# EAGLE design SixPotatoeV7 (EAGLE 9.6.0)
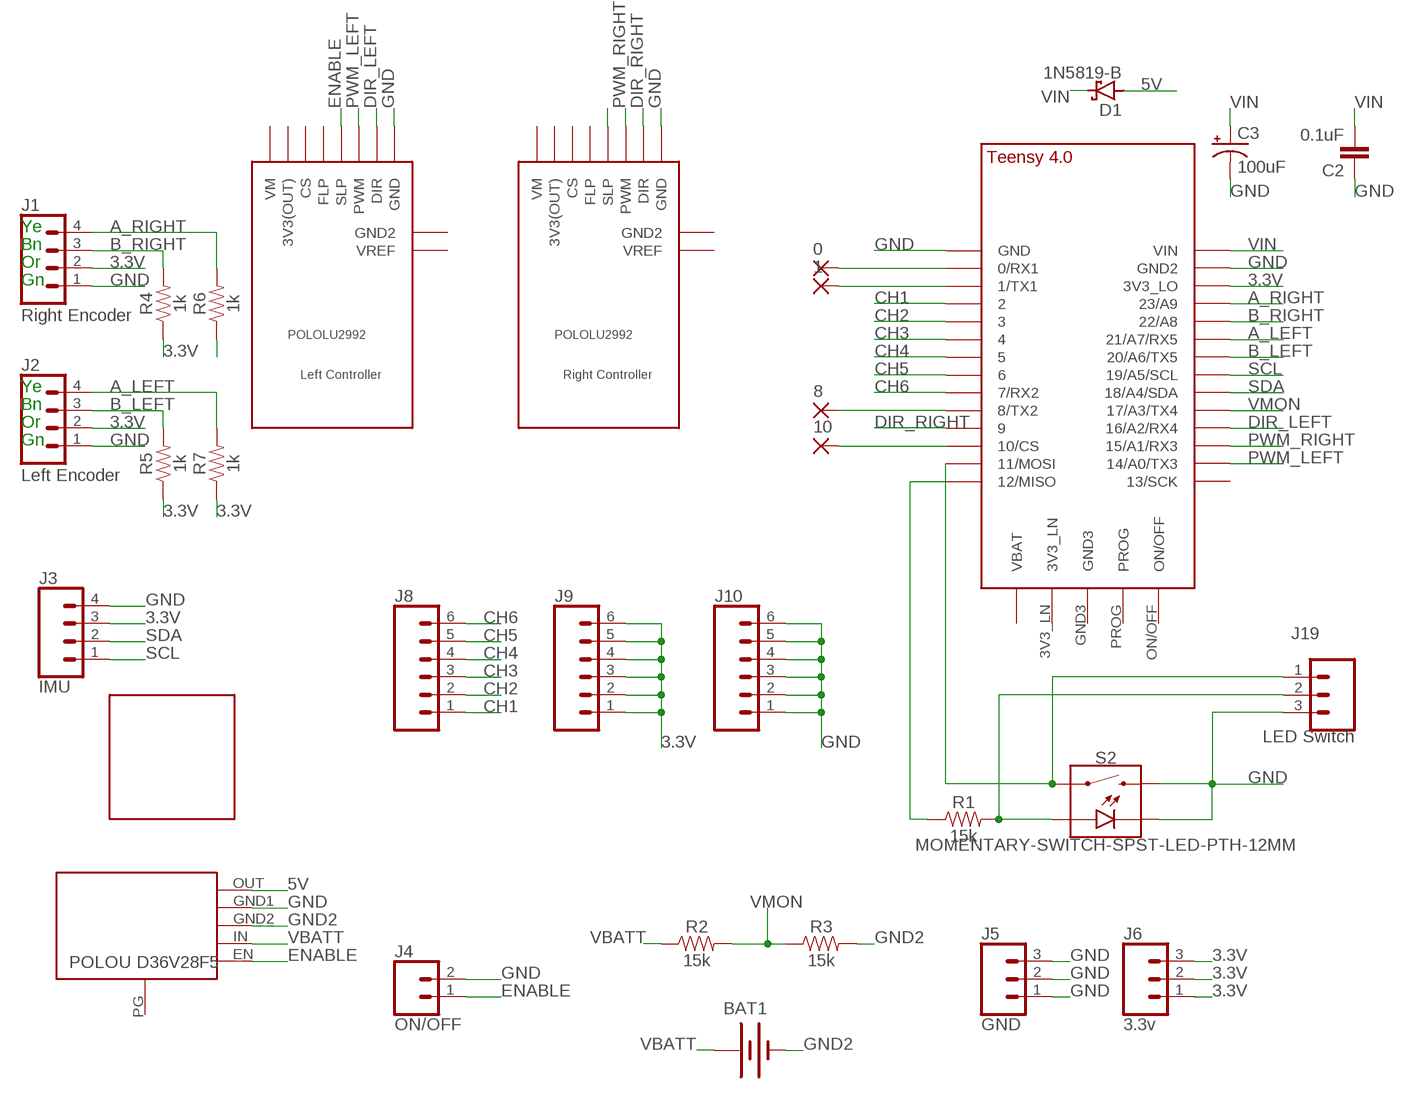
[diagram p0: schematic, sheet 1]

## Parts
0  2,15/1,0  [2,15/1,0]
1  2,15/1,0  [2,15/1,0]
8  2,15/1,0  [2,15/1,0]
10  2,15/1,0  [2,15/1,0]
BAT1  XT60_MALE  [XT60]
C2  0.1uF  0.1UF-KIT-EZ-50V-20%  [CAP-PTH-SMALL-KIT]
C3  100uF  100UF-POLAR-RADIAL-2.5MM-25V-20%  [CPOL-RADIAL-2.5MM-6.5MM]
D1  1N5819-B  [DO41-7.6]
J1  CONN_04  [1X04]
J2  CONN_04  [1X04]
J3  IMU  CONN_04  [1X04]
J4  ON/OFF  CONN_02  [1X02]
J5  GND  CONN_03  [1X03]
J6  3.3v  CONN_03  [1X03]
J8  CONN_06NO_SILK_FEMALE_PTH  [1X06_NO_SILK]
J9  CONN_06NO_SILK_FEMALE_PTH  [1X06_NO_SILK]
J10  CONN_06NO_SILK_FEMALE_PTH  [1X06_NO_SILK]
J19  CONN_03  [1X03]
R1  15k  15KOHM-HORIZ-1/4W-5%  [AXIAL-0.3]
R2  15k  15KOHM-HORIZ-1/4W-5%  [AXIAL-0.3]
R3  15k  15KOHM-HORIZ-1/4W-5%  [AXIAL-0.3]
R4  1k  1KOHM-HORIZ-1/4W-1%  [AXIAL-0.3]
R5  1k  1KOHM-HORIZ-1/4W-1%  [AXIAL-0.3]
R6  1k  1KOHM-HORIZ-1/4W-1%  [AXIAL-0.3]
R7  1k  1KOHM-HORIZ-1/4W-1%  [AXIAL-0.3]
S2  MOMENTARY-SWITCH-SPST-LED-PTH-12MM  [TACTILE_SWITCH_LED_PTH_12MM]
U$1  TEENSY_4.0  [TEENSY_4.0]
U$2  Left Controller  POLOLU2992_2  [POLOLU2992_2]
U$3  Right Controller  POLOLU2992_2  [POLOLU2992_2]
U$4  POLOU3782  [POLOU3782]
U$5  SEN15335_NO_PTH  [SEN15335_NO_PTH]

## Nets
3.3V: J1.2 J2.2 J3.3 J6.1 J6.2 J6.3 J9.1 J9.2 J9.3 J9.4 J9.5 J9.6 R4.P$1 R5.P$1 R6.P$1 R7.P$1 U$1.3V3_LO
5V: D1.A U$4.OUT
A_LEFT: J2.4 R7.P$2 U$1.21/A7(21/A7/RX5)
A_RIGHT: J1.4 R6.P$2 U$1.23/A9
B_LEFT: J2.3 R5.P$2 U$1.20/A6(20/A6/TX5)
B_RIGHT: J1.3 R4.P$2 U$1.22/A8
CH1: J8.1 U$1.2
CH2: J8.2 U$1.3/CANTX
CH3: J8.3 U$1.4/CANRX
CH4: J8.4 U$1.5
CH5: J8.5 U$1.6
CH6: J8.6 U$1.7(7/RX2)
DIR_LEFT: U$1.16/A2(16/A2/RX4) U$2.DIR
DIR_RIGHT: U$1.9/CS U$3.DIR
ENABLE: J4.1 U$2.SLP U$3.SLP U$4.EN
GND: C2.1 C3.2(-) J1.1 J2.1 J3.4 J4.2 J5.1 J5.2 J5.3 J10.1 J10.2 J10.3 J10.4 J10.5 J10.6 J19.3 S2.2 S2.C U$1.GND U$1.GND2 U$2.GND U$3.GND U$4.GND1
GND2: BAT1.- R3.P$2 U$4.GND2
N$1: 0.1(P) U$1.0/RX(0/RX1)
N$2: J19.2 R1.P$2 S2.A
N$3: R1.P$1 U$1.12/MISO
N$4: J19.1 S2.4 U$1.11/MOSI
N$5: 1.1(P) U$1.1/TX(1/TX1)
N$6: 10.1(P) U$1.10/CS
N$7: 8.1(P) U$1.8(8/TX2)
PWM_LEFT: U$1.14/A0(14/A0/TX3) U$2.PWM
PWM_RIGHT: U$1.15/A1(15/A1/RX3) U$3.PWM
SCL: J3.1 U$1.19/A5/SCL
SDA: J3.2 U$1.18/A4/SDA
VBATT: BAT1.+ R2.P$1 U$4.IN
VIN: C2.2 C3.1(+) D1.C U$1.VIN
VMON: R2.P$2 R3.P$1 U$1.17/A3(17/A3/TX4)
Unconnected: U$1.3V3_LN U$1.13/SCK U$1.GND3 U$1.ON/OFF U$1.PROG U$1.VBAT\(VBAT) U$2.3V3(OUT) U$2.CS U$2.FLP U$2.GND2 U$2.VM U$2.VREF U$3.3V3(OUT) U$3.CS U$3.FLP U$3.GND2 U$3.VM U$3.VREF U$4.PG

## Notes on the sheet
- Ye
- Bn
- Or
- Gn
- Ye
- Bn
- Or
- Gn

## Library data of the parts
0 1 8 10 = wirepad:2,15/1,0: THROUGH-HOLE PAD
BAT1 = Tristan+Robitaille's+Library:XT60_MALE: Vertical Mount Through-Hole Male (for female battery) XT60 Connector
C2 = SparkFun-Capacitors:0.1UF: 0.1µF ceramic capacitors A capacitor is a passive two-terminal electrical component used to store electrical energy temporarily in an electric field.; PROD_ID: CAP-08370
C3 = SparkFun-Capacitors:100UF-POLAR: 100µF polarized capacitors A capacitor is a passive two-terminal electrical component used to store electrical energy temporarily in an electric field.; PROD_ID: CAP-08439
D1 = diode:1N581*: 1.0A SCHOTTKY BARRIER RECTIFIER Source: http://www.diodes.com/datasheets/ds23001.pdf
J1 = SparkFun-Connectors:CONN_04: Multi connection point. Often used as Generic Header-pin footprint for 0.1 inch spaced/style header connections On any of the 0.1 inch spaced packages, you can populate with these: Break Away Headers - Straight <https://www.sparkfun.com/products/116> (PRT-00116) Break Away Male Headers - Right Angle <https://www.sparkfun.com/products/553> (PRT-00553) Female Headers <https://www.sparkfun.com/products/115> (PRT-00115) Break Away Headers - Machine Pin <https://www.sparkfun.com/products/117> (PRT-00117) Break Away Female Headers - Swiss Machine Pin <https://www.sparkfun.com/products/743> (PRT-00743) For SCREWTERMINALS and SPRING TERMINALS visit here: Screw Terimnals on SparkFun.com <https://www.sparkfun.com/search/results?term=Screw+Terminals> (5mm/3.5mm/2.54mm spacing) This device is also useful as a general connection point to wire up your design to another part of your project. Our various solder wires solder well into these plated through hole pads. Hook-Up Wire - Assortment (Stranded, 22 AWG) <https://www.sparkfun.com/products/11375> (PRT-11375) Hook-Up Wire - Assortment (Solid Core, 22 AWG) <https://www.sparkfun.com/products/11367> (PRT-11367) View the entire wire category on our website here <https://www.sparkfun.com/categories/141> Special notes: Molex polarized connector foot print use with SKU : PRT-08231 with associated crimp pins and housings. 1MM SMD Version SKU: PRT-10208; ID: Right Encoder; PROD_ID: CONN-09696
J2 = SparkFun-Connectors:CONN_04: Multi connection point. Often used as Generic Header-pin footprint for 0.1 inch spaced/style header connections On any of the 0.1 inch spaced packages, you can populate with these: Break Away Headers - Straight <https://www.sparkfun.com/products/116> (PRT-00116) Break Away Male Headers - Right Angle <https://www.sparkfun.com/products/553> (PRT-00553) Female Headers <https://www.sparkfun.com/products/115> (PRT-00115) Break Away Headers - Machine Pin <https://www.sparkfun.com/products/117> (PRT-00117) Break Away Female Headers - Swiss Machine Pin <https://www.sparkfun.com/products/743> (PRT-00743) For SCREWTERMINALS and SPRING TERMINALS visit here: Screw Terimnals on SparkFun.com <https://www.sparkfun.com/search/results?term=Screw+Terminals> (5mm/3.5mm/2.54mm spacing) This device is also useful as a general connection point to wire up your design to another part of your project. Our various solder wires solder well into these plated through hole pads. Hook-Up Wire - Assortment (Stranded, 22 AWG) <https://www.sparkfun.com/products/11375> (PRT-11375) Hook-Up Wire - Assortment (Solid Core, 22 AWG) <https://www.sparkfun.com/products/11367> (PRT-11367) View the entire wire category on our website here <https://www.sparkfun.com/categories/141> Special notes: Molex polarized connector foot print use with SKU : PRT-08231 with associated crimp pins and housings. 1MM SMD Version SKU: PRT-10208; ID: Left Encoder; PROD_ID: CONN-09696
J3 = SparkFun-Connectors:CONN_04: Multi connection point. Often used as Generic Header-pin footprint for 0.1 inch spaced/style header connections On any of the 0.1 inch spaced packages, you can populate with these: Break Away Headers - Straight <https://www.sparkfun.com/products/116> (PRT-00116) Break Away Male Headers - Right Angle <https://www.sparkfun.com/products/553> (PRT-00553) Female Headers <https://www.sparkfun.com/products/115> (PRT-00115) Break Away Headers - Machine Pin <https://www.sparkfun.com/products/117> (PRT-00117) Break Away Female Headers - Swiss Machine Pin <https://www.sparkfun.com/products/743> (PRT-00743) For SCREWTERMINALS and SPRING TERMINALS visit here: Screw Terimnals on SparkFun.com <https://www.sparkfun.com/search/results?term=Screw+Terminals> (5mm/3.5mm/2.54mm spacing) This device is also useful as a general connection point to wire up your design to another part of your project. Our various solder wires solder well into these plated through hole pads. Hook-Up Wire - Assortment (Stranded, 22 AWG) <https://www.sparkfun.com/products/11375> (PRT-11375) Hook-Up Wire - Assortment (Solid Core, 22 AWG) <https://www.sparkfun.com/products/11367> (PRT-11367) View the entire wire category on our website here <https://www.sparkfun.com/categories/141> Special notes: Molex polarized connector foot print use with SKU : PRT-08231 with associated crimp pins and housings. 1MM SMD Version SKU: PRT-10208; PROD_ID: CONN-09696
J4 = SparkFun-Connectors:CONN_02: Multi connection point. Often used as Generic Header-pin footprint for 0.1 inch spaced/style header connections On any of the 0.1 inch spaced packages, you can populate with these: Break Away Headers - Straight <https://www.sparkfun.com/products/116> (PRT-00116) Break Away Male Headers - Right Angle <https://www.sparkfun.com/products/553> (PRT-00553) Female Headers <https://www.sparkfun.com/products/115> (PRT-00115) Break Away Headers - Machine Pin <https://www.sparkfun.com/products/117> (PRT-00117) Break Away Female Headers - Swiss Machine Pin <https://www.sparkfun.com/products/743> (PRT-00743) For SCREWTERMINALS and SPRING TERMINALS visit here: Screw Terimnals on SparkFun.com <https://www.sparkfun.com/search/results?term=Screw+Terminals> (5mm/3.5mm/2.54mm spacing) This device is also useful as a general connection point to wire up your design to another part of your project. Our various solder wires solder well into these plated through hole pads. Hook-Up Wire - Assortment (Stranded, 22 AWG) <https://www.sparkfun.com/products/11375> (PRT-11375) Hook-Up Wire - Assortment (Solid Core, 22 AWG) <https://www.sparkfun.com/products/11367> (PRT-11367) View the entire wire category on our website here <https://www.sparkfun.com/categories/141> Special notes: Molex polarized connector foot print use with: PRT-08233 with associated crimp pins and housings. 2.54_SCREWTERM for use with PRT-10571. 3.5mm Screw Terminal footprints for PRT-08084 5mm Screw Terminal footprints for use with PRT-08432
J5 J6 = SparkFun-Connectors:CONN_03: Multi connection point. Often used as Generic Header-pin footprint for 0.1 inch spaced/style header connections On any of the 0.1 inch spaced packages, you can populate with these: Break Away Headers - Straight <https://www.sparkfun.com/products/116> (PRT-00116) Break Away Male Headers - Right Angle <https://www.sparkfun.com/products/553> (PRT-00553) Female Headers <https://www.sparkfun.com/products/115> (PRT-00115) Break Away Headers - Machine Pin <https://www.sparkfun.com/products/117> (PRT-00117) Break Away Female Headers - Swiss Machine Pin <https://www.sparkfun.com/products/743> (PRT-00743) Stackable Header - 3 Pin (Female, 0.1") <https://www.sparkfun.com/products/13875> (PRT-13875) For SCREWTERMINALS and SPRING TERMINALS visit here: Screw Terimnals on SparkFun.com <https://www.sparkfun.com/search/results?term=Screw+Terminals> (5mm/3.5mm/2.54mm spacing) This device is also useful as a general connection point to wire up your design to another part of your project. Our various solder wires solder well into these plated through hole pads. Hook-Up Wire - Assortment (Stranded, 22 AWG) <https://www.sparkfun.com/products/11375> (PRT-11375) Hook-Up Wire - Assortment (Solid Core, 22 AWG) <https://www.sparkfun.com/products/11367> (PRT-11367) View the entire wire category on our website here <https://www.sparkfun.com/categories/141> Special notes: Molex polarized connector foot print use with SKU : PRT-08232 with associated crimp pins and housings.
J8-J10 = SparkFun-Connectors:CONN_06: Multi connection point. Often used as Generic Header-pin footprint for 0.1 inch spaced/style header connections On any of the 0.1 inch spaced packages, you can populate with these: Break Away Headers - Straight <https://www.sparkfun.com/products/116> (PRT-00116) Break Away Male Headers - Right Angle <https://www.sparkfun.com/products/553> (PRT-00553) Female Headers <https://www.sparkfun.com/products/115> (PRT-00115) Break Away Headers - Machine Pin <https://www.sparkfun.com/products/117> (PRT-00117) Break Away Female Headers - Swiss Machine Pin <https://www.sparkfun.com/products/743> (PRT-00743) Arduino Stackable Header - 6 Pin <https://www.sparkfun.com/products/9280> (PRT-09280) For SCREWTERMINALS and SPRING TERMINALS visit here: Screw Terimnals on SparkFun.com <https://www.sparkfun.com/search/results?term=Screw+Terminals> (5mm/3.5mm/2.54mm spacing) This device is also useful as a general connection point to wire up your design to another part of your project. Our various solder wires solder well into these plated through hole pads. Hook-Up Wire - Assortment (Stranded, 22 AWG) <https://www.sparkfun.com/products/11375> (PRT-11375) Hook-Up Wire - Assortment (Solid Core, 22 AWG) <https://www.sparkfun.com/products/11367> (PRT-11367) View the entire wire category on our website here <https://www.sparkfun.com/categories/141>; PROD_ID: CONN-08437
J19 = SparkFun-Connectors:CONN_03: Multi connection point. Often used as Generic Header-pin footprint for 0.1 inch spaced/style header connections On any of the 0.1 inch spaced packages, you can populate with these: Break Away Headers - Straight <https://www.sparkfun.com/products/116> (PRT-00116) Break Away Male Headers - Right Angle <https://www.sparkfun.com/products/553> (PRT-00553) Female Headers <https://www.sparkfun.com/products/115> (PRT-00115) Break Away Headers - Machine Pin <https://www.sparkfun.com/products/117> (PRT-00117) Break Away Female Headers - Swiss Machine Pin <https://www.sparkfun.com/products/743> (PRT-00743) Stackable Header - 3 Pin (Female, 0.1") <https://www.sparkfun.com/products/13875> (PRT-13875) For SCREWTERMINALS and SPRING TERMINALS visit here: Screw Terimnals on SparkFun.com <https://www.sparkfun.com/search/results?term=Screw+Terminals> (5mm/3.5mm/2.54mm spacing) This device is also useful as a general connection point to wire up your design to another part of your project. Our various solder wires solder well into these plated through hole pads. Hook-Up Wire - Assortment (Stranded, 22 AWG) <https://www.sparkfun.com/products/11375> (PRT-11375) Hook-Up Wire - Assortment (Solid Core, 22 AWG) <https://www.sparkfun.com/products/11367> (PRT-11367) View the entire wire category on our website here <https://www.sparkfun.com/categories/141> Special notes: Molex polarized connector foot print use with SKU : PRT-08232 with associated crimp pins and housings.; ID: LED Switch
R1-R3 = SparkFun-Resistors:15KOHM: 15kΩ resistor A resistor is a passive two-terminal electrical component that implements electrical resistance as a circuit element. Resistors act to reduce current flow, and, at the same time, act to lower voltage levels within circuits. - Wikipedia; PROD_ID: RES-11360
R4-R7 = SparkFun-Resistors:1KOHM: 1kΩ resistor A resistor is a passive two-terminal electrical component that implements electrical resistance as a circuit element. Resistors act to reduce current flow, and, at the same time, act to lower voltage levels within circuits. - Wikipedia; PROD_ID: RES-12182
S2 = TimEagleLibrary:MOMENTARY-SWITCH-SPST-LED: Momentary Switch (Pushbutton) - SPST - w/ LED Normally-open (NO) SPST momentary switches (buttons, pushbuttons), with a built-in LED. Variants PTH-CHERRY - Cherry MX Switch Cherry MX Keyswitches are top-of-the-line mechanical keyboard switches. They’re satisfyingly “clicky”, reliable up to tens-of-millions of key presses, and a standard in gaming and programming keyboards across the globe. This ‘blue’ version Cherry MX Switch is favored by most due to its secondary internal actuator making it less likely to “double-tap.” If you are looking for a noticeably audible and high-quality key switch, this is the perfect option for you! Cherry MX Switch <https://www.sparkfun.com/products/13834> (COM-13834) Cherry MX Switch Breakout <https://www.sparkfun.com/products/13773> (BOB-13773) PTH-12MM and PTH-12MM-KIT - 12mm Illuminated LED KIT variant is for soldering kits. There is no tStop (covering up the top side of the pads with mask). This helps the beginner see which side they should be soldering too. LED Tactile Button Breakout <https://www.sparkfun.com/products/10467> (BOB-10467) LED Tactile Button - Red <https://www.sparkfun.com/products/10442> (COM-10442) LED Tactile Button - Blue <https://www.sparkfun.com/products/10443> (COM-10443) LED Tactile Button - Green <https://www.sparkfun.com/products/10440> (COM-10440) LED Tactile Button - Orange <https://www.sparkfun.com/products/10441> (COM-10441) LED Tactile Button - White <https://www.sparkfun.com/products/10439> (COM-10439); PROD_ID: SWCH-11758; SF_SKU: COM-10442
U$1 = TEENSY 4.0:TEENSY_4.0
U$2 U$3 = TimEagleLibrary:POLOLU2992_2
U$4 = TimEagleLibrary:POLOU3782
U$5 = TimEagleLibrary:SEN15335_NO_PTH

## Board
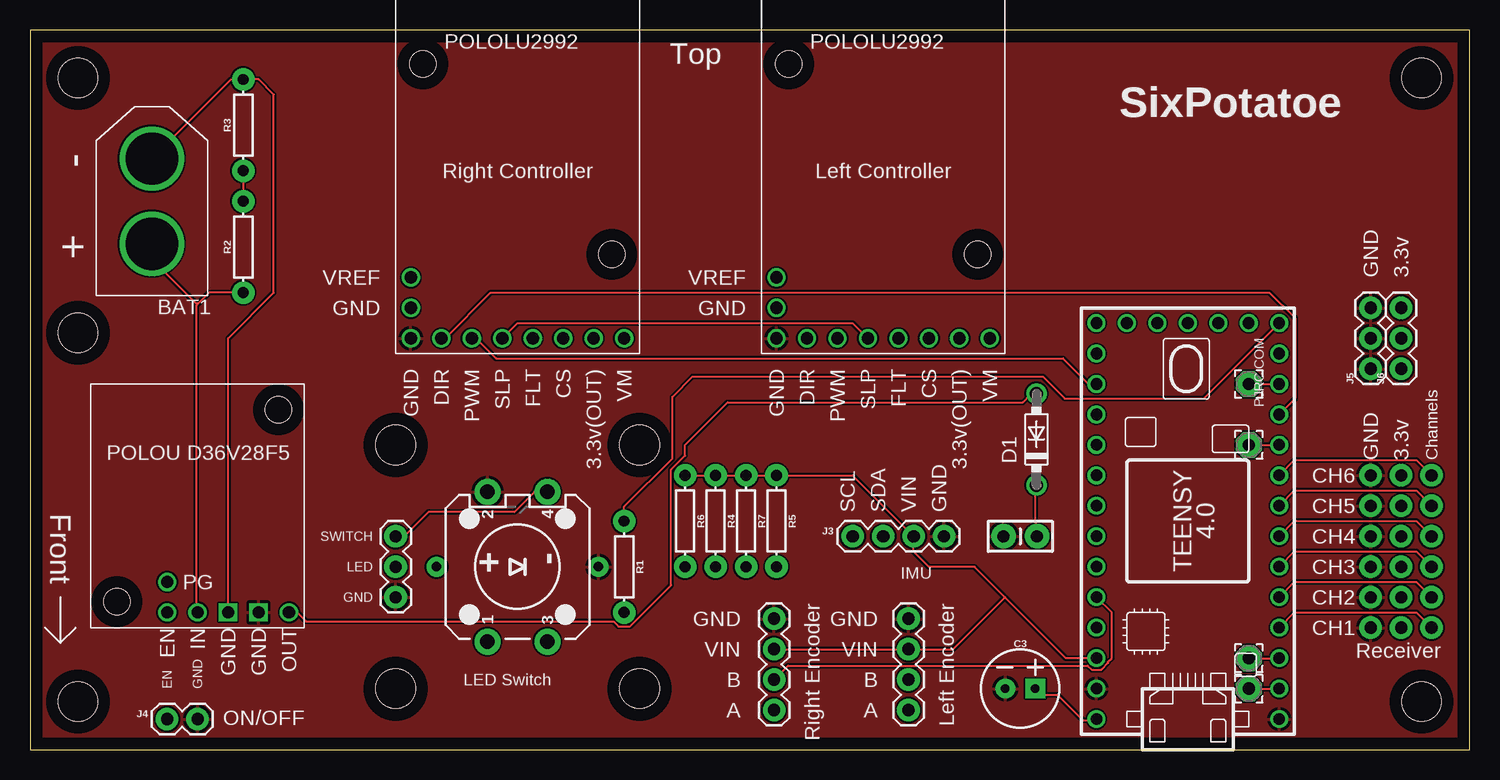
[diagram p1: board, top side]
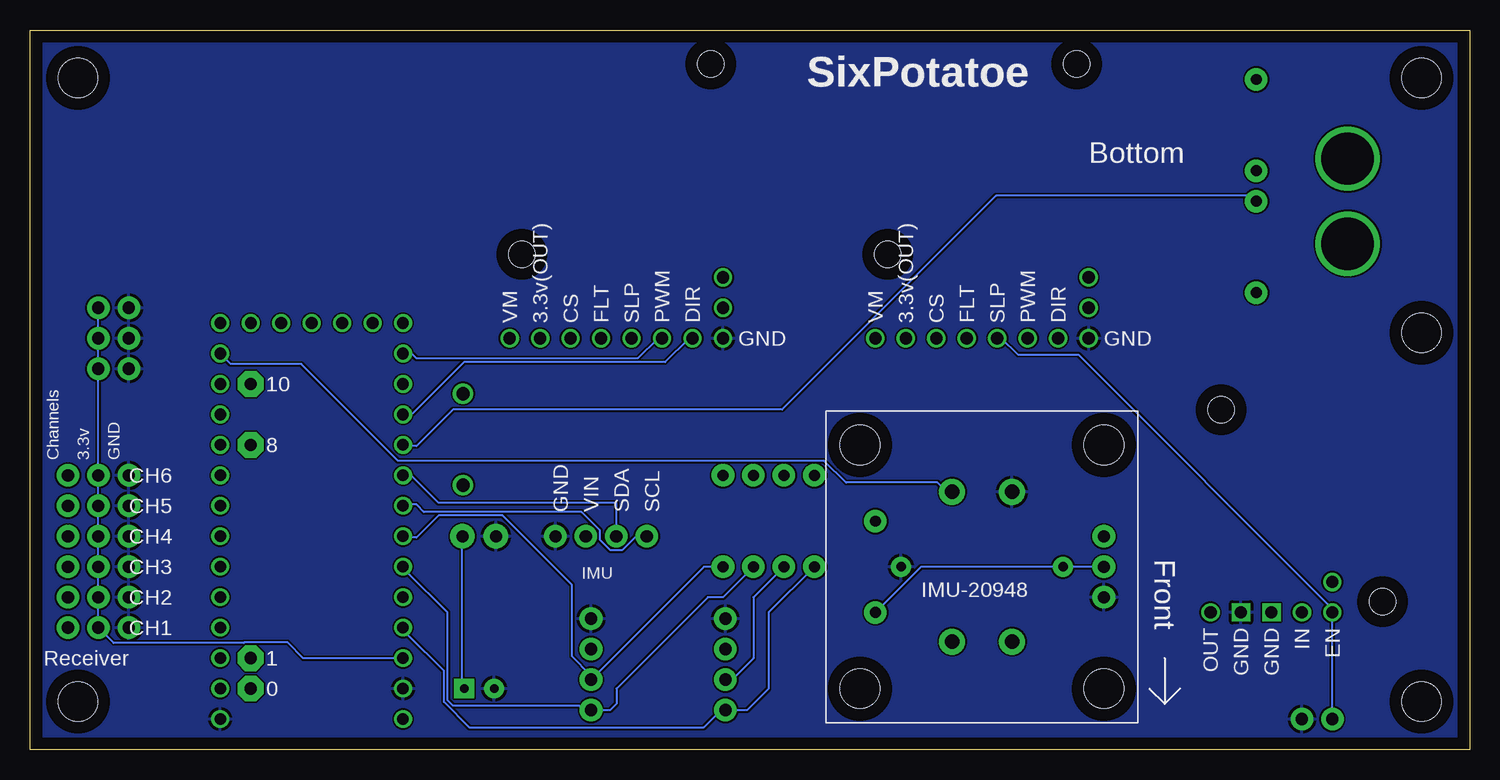
[diagram p2: board, bottom side, seen from below]

Size 120 x 60 mm. Coordinates in mm from the lower left corner, seen from the top.
Outline: 0,0 120,0 120,60 0,60 0,0
Copper layers (1*16): Top 0.035mm / dielectric 1.5mm / Bottom 0.035mm
Design rules "default": minimum track width 6mil, minimum drill 0.35mm, track to track 6mil, track to pad 6mil, pad to pad 6mil, via to via 6mil, smd to smd 6mil, copper to edge 40mil, drill to drill 6mil, minimum pad ring 10mil, minimum via ring 8mil, stop-mask expansion 4mil, vias tented up to drill 0mil, thermal gap 10mil
Holes 3.25 mm at 116,56 116,4 4,4 4,56 4,34.75

### Footprints (pad centres in the part's own frame; a part is rotated, then mirrored left to right if it is on the bottom)
2,15/1,0 = drill 1.016 pad 2.159 octagon: 1 0,0
XT60 = drill 4.35: + 3.55,0; - -3.55,0
CAP-PTH-SMALL-KIT = drill 1.016 pad 2.032: 1 -1.397,0; 2 1.397,0
CPOL-RADIAL-2.5MM-6.5MM = drill 0.7 pad 1.651 square: 1 1.25,0 | drill 0.7 pad 1.651: 2 -1.25,0
DO41-7.6 = drill 1.1 pad 1.7: A 3.81,0; C -3.81,0
1X04 = drill 1.016 pad 1.88: 1 0,0; 2 2.54,0; 3 5.08,0; 4 7.62,0
1X02 = drill 1.016 pad 1.88: 1 0,0; 2 2.54,0
1X03 = drill 1.016 pad 1.88: 1 0,0; 2 2.54,0; 3 5.08,0
1X06_NO_SILK = drill 1.016 pad 1.88: 1 0,0; 2 2.54,0; 3 5.08,0; 4 7.62,0; 5 10.16,0; 6 12.7,0
AXIAL-0.3 = drill 0.9 pad 1.88: P$1 -3.81,0; P$2 3.81,0
TACTILE_SWITCH_LED_PTH_12MM = drill 1.2 pad 2.159: 1 -6.25,2.5; 2 6.25,2.5; 3 -6.25,-2.5; 4 6.25,-2.5 | drill 0.8 pad 1.676: A 0,6.75; C 0,-6.75
TEENSY_4.0 = drill 0.965: 0/RX -13.97,-7.62; 1/TX -11.43,-7.62; 2 -8.89,-7.62; 3/CANTX -6.35,-7.62; 3V3_LN 16.51,-2.54; 3V3_LO -11.43,7.62; 4/CANRX -3.81,-7.62; 5 -1.27,-7.62; 6 1.27,-7.62; 7 3.81,-7.62; 8 6.35,-7.62; 9/CS 8.89,-7.62; 10/CS 11.43,-7.62; 11/MOSI 13.97,-7.62; 12/MISO 16.51,-7.62; 13/SCK 16.51,7.62; 14/A0 13.97,7.62; 15/A1 11.43,7.62; 16/A2 8.89,7.62; 17/A3 6.35,7.62; 18/A4/SDA 3.81,7.62; 19/A5/SCL 1.27,7.62; 20/A6 -1.27,7.62; 21/A7 -3.81,7.62; 22/A8 -6.35,7.62; 23/A9 -8.89,7.62; GND -16.51,-7.62; GND2 -13.97,7.62; GND3 16.51,0; ON/OFF 16.51,5.08; PROG 16.51,2.54; VBAT\ 16.51,-5.08; VIN -16.51,7.62
POLOLU2992_2 = drill 1.016: 3V3(OUT) 3.81,31.75; CS 6.35,31.75; DIR 16.51,31.75; FLP 8.89,31.75; GND 19.05,31.75; GND2 19.05,29.21; PWM 13.97,31.75; SLP 11.43,31.75; VM 1.27,31.75; VREF 19.05,26.67 | hole 2.184: 2.286,24.765; 18.034,8.89
POLOU3782 = drill 1.016: EN -2.54,-7.62; IN 0,-7.62; OUT 7.62,-7.62; PG -2.54,-5.08 | drill 1.016 square: GND1 5.08,-7.62; GND2 2.54,-7.62 | hole 2.184: -6.731,-6.731; 6.731,9.271
SEN15335_NO_PTH = hole 3.302: -10.16,10.16; 10.16,10.16; 10.16,-10.16; -10.16,-10.16

### Placement (x,y rotation side)
0  101.6,5.08 90 top
1  101.6,7.62 90 top
8  101.6,25.4 90 top
10  101.6,30.48 90 top
BAT1  10.16,45.72 270 top
C2  82.55,17.78 0 top
C3  82.55,5.08 0 top
D1  83.9,25.86 90 top
J1  62.03,10.91 270 top
J2  73.23,10.91 270 top
J3  68.58,17.78 0 top
J4  11.43,2.54 0 top
J5  111.76,31.75 90 top
J6  114.3,31.75 90 top
J8  116.84,10.16 90 top
J9  114.3,10.16 90 top
J10  111.76,10.16 90 top
J19  30.48,17.78 270 top
R1  49.53,15.24 270 top
R2  17.78,41.91 90 top
R3  17.78,52.07 90 top
R4  57.15,19.05 270 top
R5  62.23,19.05 270 top
R6  54.61,19.05 270 top
R7  59.69,19.05 270 top
S2  40.64,15.24 90 top
U$1  96.52,19.05 90 top
U$2  81.28,66.04 180 top
U$3  50.8,66.04 180 top
U$4  13.97,19.05 0 top
U$5  40.64,15.24 0 bottom

### Tracks (layer width: path | path; a pad name or v marks a point on that pad's centre or on a via)
3.3V
  Top 0.152: U$1.3V3_LO 86.36,7.62 81.28,12.7 | 81.28,12.7 78.74,15.24 74.93,15.24 73.66,16.51 J3.3 68.58,22.86 R5.P$1 R7.P$1 R4.P$1 R6.P$1 | J1.2 J2.2 76.95,8.37 81.28,12.7
  Bottom 0.152: U$1.3V3_LO 97.21,7.62 98.52,8.93 102.14,8.93 102.18,8.89 113.03,8.89 J9.1 J9.2 J9.3 J9.4 J9.5 J9.6 J6.1 J6.2 J6.3
5V
  Top 0.152: U$4.OUT 22.25,11.43 23.01,10.67 48.64,10.67 49.05,10.26 50.01,10.26 53.44,13.69 53.44,23.34 54.61,24.51 54.61,25.4 58.17,28.96 82.75,28.96 83.36,29.57 83.82,29.57 D1.A
A_LEFT
  Bottom 0.152: U$1.21/A7 88.85,15.24 88.54,14.94 88.54,14.78 85.19,11.43 85.19,4.12 84.73,3.66 74.22,3.66 73.91,3.35 73.3,3.35 J2.4 71.64,3.29 71.12,3.81 71.12,5.08 63.5,12.7 62.23,12.7 R7.P$2
A_RIGHT
  Bottom 0.152: U$1.23/A9 88.85,10.06 88.54,9.75 88.54,9.6 85.5,6.55 85.5,3.96 83.36,1.83 63.86,1.83 62.48,3.2 62.18,3.2 J1.4 60.21,3.29 58.42,5.08 58.42,11.43 R6.P$2
B_LEFT
  Bottom 0.152: U$1.20/A6 88.85,17.68 87.78,17.68 85.95,19.51 80.62,19.51 74.83,13.72 74.83,7.77 73.3,6.25 73.3,5.94 J2.3 63.82,15.24 R5.P$2
B_RIGHT
  Top 0.152: J1.3 63.2,7 88.16,7 88.5,6.66 89.3,6.66 89.86,7.22 89.86,7.32 90.17,7.62 90.17,11.43 U$1.22/A8
  Bottom 0.152: R4.P$2 59.69,12.7 59.69,7.62 61.48,5.83 J1.3
CH1
  Top 0.152: U$1.2 105.41,11.43 115.57,11.43 J8.1
CH2
  Top 0.152: U$1.3/CANTX 105.41,13.97 115.57,13.97 J8.2
CH3
  Top 0.152: U$1.4/CANRX 105.41,16.51 115.57,16.51 J8.3
CH4
  Top 0.152: U$1.5 105.41,19.05 115.57,19.05 J8.4
CH5
  Top 0.152: U$1.6 105.41,21.59 115.57,21.59 J8.5
CH6
  Top 0.152: U$1.7 105.41,24.13 115.57,24.13 J8.6
DIR_LEFT
  Bottom 0.152: U$2.DIR 65.08,34.29 67.06,32.31 83.82,32.31 88.09,28.04 88.85,28.04 U$1.16/A2
DIR_RIGHT
  Top 0.152: U$3.DIR 34.59,34.29 38.41,38.1 103.33,38.1 105.46,35.97 105.46,29.26 U$1.9/CS
ENABLE
  Top 0.152: U$3.SLP 40.64,35.56 68.58,35.56 U$2.SLP
  Bottom 0.152: U$3.SLP 39.01,34.29 37.64,32.92 32.61,32.92 11.43,11.73 U$4.EN J4.1
GND
  pour Bottom: 0,60 120,60 120,0 0,0
  pour Top: 0,60 120,60 120,0 0,0
GND2
  Top 0.152: BAT1.- 16.77,55.88 R3.P$2 19.05,55.88 20.32,54.61 20.32,38.1 16.51,34.29 U$4.GND2
N$1
  Top 0.152: 0.1 U$1.0/RX
N$2
  Bottom 0.152: J19.2 S2.A 45.72,15.24 R1.P$2
N$3
  Top 0.152: U$1.12/MISO 97.84,29.26 86.26,29.26 84.43,31.09 55.22,31.09 53.54,29.41 53.54,24.26 49.53,20.25 R1.P$1
N$4
  Top 0.152: J19.1 30.48,17.83 31.24,17.83 33.22,19.81 40.39,19.81 42.06,21.49 43.13,21.49 S2.4
  Bottom 0.152: S2.4 43.28,21.64 43.74,21.64 44.35,22.25 51.97,22.25 53.8,24.08 89.31,24.08 97.38,32.16 103.28,32.16 U$1.11/MOSI
N$5
  Top 0.152: 1.1 U$1.1/TX
N$6
  Top 0.152: 10.1 U$1.10/CS
N$7
  Top 0.152: 8.1 U$1.8
PWM_LEFT
  Bottom 0.152: U$2.PWM 67.67,34.29 69.34,32.61 87.78,32.61 88.09,32.92 88.85,32.92 U$1.14/A0
PWM_RIGHT
  Top 0.152: U$1.15/A1 88.24,30.48 86.11,32.61 38.86,32.61 37.19,34.29 U$3.PWM
SCL
  Bottom 0.152: U$1.19/A5/SCL 88.85,20.42 87.78,20.42 87.17,19.81 74.04,19.81 72.49,18.26 72.49,17.5 71.6,16.61 70.64,16.61 69.47,17.78 J3.1
SDA
  Bottom 0.152: U$1.18/A4/SDA 88.24,22.86 85.95,20.57 71.12,20.57 J3.2
VBATT
  Top 0.152: 14.02,37.19 14.94,38.1 R2.P$1 | 14.02,37.19 13.87,37.03 13.87,11.43 U$4.IN | 14.02,37.19 13.87,37.19 10.16,40.89 BAT1.+
VIN
  Top 0.152: D1.C 83.82,21.95 83.82,18.9 83.97,18.75 83.97,17.83 C2.2 | U$1.VIN 88.85,2.44 87.78,2.44 85.65,4.57 84.28,4.57 83.82,5.03 C3.1
  Bottom 0.152: C2.2 83.97,17.68 83.97,5.33 83.82,5.18 C3.1
VMON
  Top 0.152: R3.P$1 R2.P$2
  Bottom 0.152: U$1.17/A3 88.85,25.3 87.78,25.3 84.73,28.35 57.3,28.35 39.47,46.18 17.78,46.18 R2.P$2

### Text on the board
tPlace: Top | SixPotatoe | GND | 3.3v | GND | 3.3v | Channels | CH6 | Front | SCL | SDA | VIN | GND | CH5 | SWITCH | CH4 | LED | IMU | CH3 | PG | GND | CH2 | Right Encoder | Left Encoder | GND | GND | EN | IN | GND | GND | OUT | CH1 | VIN | VIN | Receiver | LED Switch | B | B | EN | GND | A | A | ON/OFF
bPlace: SixPotatoe | Bottom | DIR | PWM | SLP | FLT | CS | 3.3v(OUT) | VM | DIR | PWM | SLP | FLT | CS | 3.3v(OUT) | VM | GND | GND | 10 | 8 | GND | 3.3v | Channels | CH6 | SCL | SDA | VIN | GND | CH5 | CH4 | Front | IMU | CH3 | IMU-20948 | CH2 | EN | IN | GND | GND | OUT | CH1 | Receiver | 1 | 0